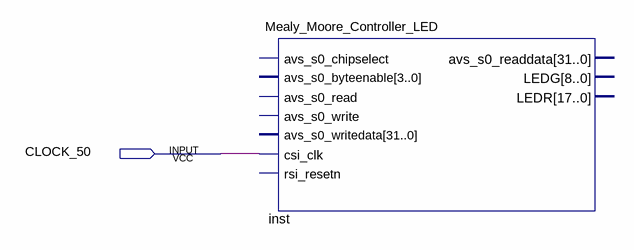
[diagram p0: schematic sheet]
// Quartus schematic MealyMoure_Controller.bdf as structural Verilog: 1 symbols, 1 pins
module MealyMoure_Controller (
  input  CLOCK_50
);

  Mealy_Moore_Controller_LED inst (.csi_clk(CLOCK_50));  // open: avs_s0_chipselect, avs_s0_byteenable, avs_s0_read, avs_s0_write, avs_s0_writedata, rsi_resetn, avs_s0_readdata, LEDG, LEDR
endmodule
